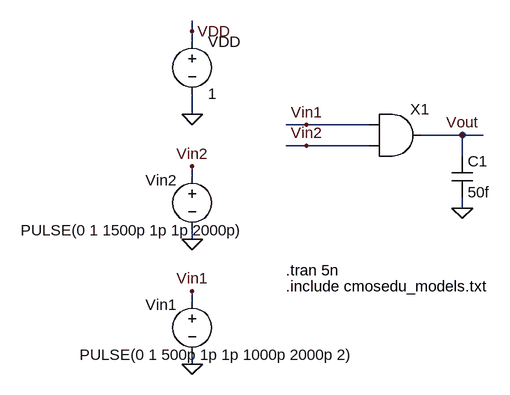
[diagram p0: schematic 6-AND2.asc]
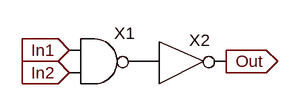
[diagram p1: sub-circuit and2.asc]
6-AND2.asc, the LTspice schematic file:
Version 4
SHEET 1 1136 680
WIRE 160 -496 160 -512
WIRE 160 -480 160 -496
WIRE 160 -368 160 -400
WIRE 336 -352 304 -352
WIRE 432 -352 336 -352
WIRE 576 -336 512 -336
WIRE 608 -336 576 -336
WIRE 336 -320 304 -320
WIRE 432 -320 336 -320
WIRE 576 -304 576 -336
WIRE 160 -272 160 -288
WIRE 576 -224 576 -240
WIRE 160 -176 160 -192
WIRE 160 -80 160 -96
WIRE 160 16 160 0
FLAG 160 16 0
FLAG 160 -96 Vin1
FLAG 160 -368 0
FLAG 160 -496 VDD
FLAG 576 -336 Vout
FLAG 576 -224 0
FLAG 336 -352 Vin1
FLAG 336 -320 Vin2
FLAG 160 -176 0
FLAG 160 -288 Vin2
SYMBOL voltage 160 -96 R0
WINDOW 0 -72 21 Left 2
WINDOW 3 -173 98 Left 2
WINDOW 123 0 0 Left 2
WINDOW 39 0 0 Left 2
SYMATTR InstName Vin1
SYMATTR Value PULSE(0 1 500p 1p 1p 1000p 2000p 2)
SYMBOL voltage 160 -496 R0
WINDOW 123 0 0 Left 2
WINDOW 39 0 0 Left 2
SYMATTR InstName VDD
SYMATTR Value 1
SYMBOL cap 560 -304 R0
SYMATTR InstName C1
SYMATTR Value 50f
SYMBOL voltage 160 -288 R0
WINDOW 0 -72 21 Left 2
WINDOW 3 -264 98 Left 2
WINDOW 123 0 0 Left 2
WINDOW 39 0 0 Left 2
SYMATTR InstName Vin2
SYMATTR Value PULSE(0 1 1500p 1p 1p 2000p)
SYMBOL AND2 480 -400 R0
SYMATTR InstName X1
TEXT 304 -128 Left 2 !.tran 5n
TEXT 304 -104 Left 2 !.include cmosedu_models.txt

and2.asc, the sub-circuit schematic file:
Version 4
SHEET 1 1136 680
FLAG 592 272 Out
IOPIN 592 272 Out
FLAG 368 256 In1
IOPIN 368 256 In
FLAG 368 288 In2
IOPIN 368 288 In
SYMBOL NAND2 416 208 R0
SYMATTR InstName X1
SYMBOL NOT 496 240 R0
SYMATTR InstName X2

The netlist it stands for:
* 6-AND2.asc
Vin1 Vin1 0 PULSE(0 1 500p 1p 1p 1000p 2000p 2)
VDD VDD 0 1
C1 Vout 0 50f
Vin2 Vin2 0 PULSE(0 1 1500p 1p 1p 2000p)
XX1 Vin1 Vin2 Vout and2

* block symbol definitions
.subckt and2 In1 In2 Out
XX1 In1 In2 P001 NAND2  ; pins In1 In2 Out
XX2 P001 Out NOT  ; pins In Out
.ends and2

.tran 5n
.include cmosedu_models.txt
.backanno
.end